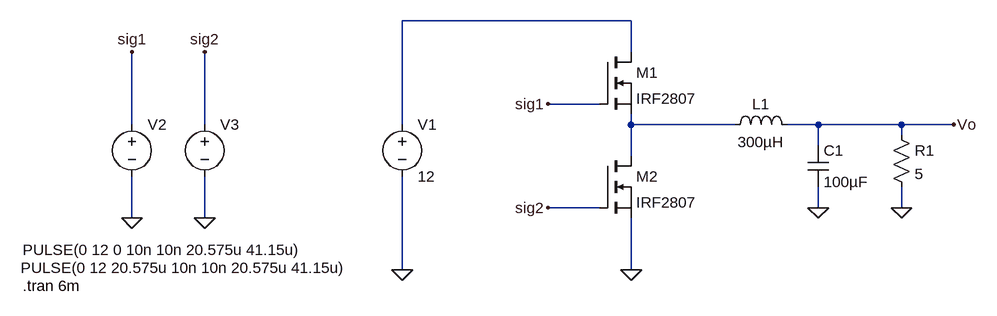
[diagram p0: schematic buck_ltSpice.asc]
buck_ltSpice.asc, the LTspice schematic file:
Version 4
SHEET 1 880 680
WIRE 240 -16 -112 -16
WIRE 240 32 240 -16
WIRE 192 112 112 112
WIRE -528 144 -528 32
WIRE -416 144 -416 32
WIRE -112 144 -112 -16
WIRE 240 144 240 128
WIRE 400 144 240 144
WIRE 528 144 480 144
WIRE 656 144 528 144
WIRE 736 144 656 144
WIRE 656 160 656 144
WIRE 528 176 528 144
WIRE 240 192 240 144
WIRE 192 272 112 272
WIRE 528 272 528 240
WIRE 656 272 656 240
WIRE -528 288 -528 224
WIRE -416 288 -416 224
WIRE -112 368 -112 224
WIRE 240 368 240 288
FLAG 240 368 0
FLAG -112 368 0
FLAG -528 288 0
FLAG 112 112 sig1
FLAG -528 32 sig1
FLAG 112 272 sig2
FLAG -416 288 0
FLAG -416 32 sig2
FLAG 528 272 0
FLAG 656 272 0
FLAG 736 144 Vo
SYMBOL nmos 192 32 R0
SYMATTR InstName M1
SYMATTR Value IRF2807
SYMBOL nmos 192 192 R0
SYMATTR InstName M2
SYMATTR Value IRF2807
SYMBOL voltage -112 128 R0
WINDOW 123 0 0 Left 2
WINDOW 39 0 0 Left 2
SYMATTR InstName V1
SYMATTR Value 12
SYMBOL voltage -528 128 R0
WINDOW 3 -168 209 Left 2
WINDOW 123 0 0 Left 2
WINDOW 39 0 0 Left 2
SYMATTR Value PULSE(0 12 0 10n 10n 20.575u 41.15u)
SYMATTR InstName V2
SYMBOL voltage -416 128 R0
WINDOW 3 -283 237 Left 2
WINDOW 123 0 0 Left 2
WINDOW 39 0 0 Left 2
SYMATTR Value PULSE(0 12 20.575u 10n 10n 20.575u 41.15u)
SYMATTR InstName V3
SYMBOL ind 384 160 R270
WINDOW 0 32 56 VTop 2
WINDOW 3 5 56 VBottom 2
SYMATTR InstName L1
SYMATTR Value 300µH
SYMBOL cap 512 176 R0
SYMATTR InstName C1
SYMATTR Value 100µF
SYMBOL res 640 144 R0
SYMATTR InstName R1
SYMATTR Value 5
TEXT -696 392 Left 2 !.tran 6m

The netlist it stands for:
* buck_ltSpice.asc
M1 N001 sig1 N002 N002 IRF2807
M2 N002 sig2 0 0 IRF2807
V1 N001 0 12
V2 sig1 0 PULSE(0 12 0 10n 10n 20.575u 41.15u)
V3 sig2 0 PULSE(0 12 20.575u 10n 10n 20.575u 41.15u)
L1 N002 Vo 300µH
C1 Vo 0 100µF
R1 Vo 0 5
.model NMOS NMOS
.model PMOS PMOS
.lib standard.mos
.tran 6m
.backanno
.end

* Results of the author's LTspice run, read from the files saved beside the schematic
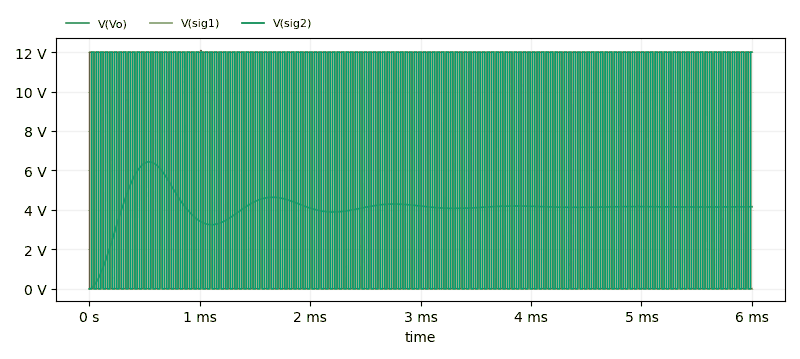
[diagram p1: Transient Analysis of buck_ltSpice.asc, plotted from the saved traces]
* Transient Analysis, 1 run:
*   V(Vo): min 0 V, max 6.437 V, average 4.13 V, rms 4.211 V, last 4.164 V
*   V(sig1): min 0 V, max 12.09 V, average 6.011 V, rms 8.492 V, last 0 V
*   V(sig2): min 0 V, max 12 V, average 5.995 V, rms 8.481 V, last 12 V